# Altium schematic sheet USB-C_BREAKOUT_TITLE.SchDoc
size Tabloid; DocumentNumber: 1; SheetNumber: 1; SheetTotal: 2; Sheet_Name: Title sheet; Size: 11x17
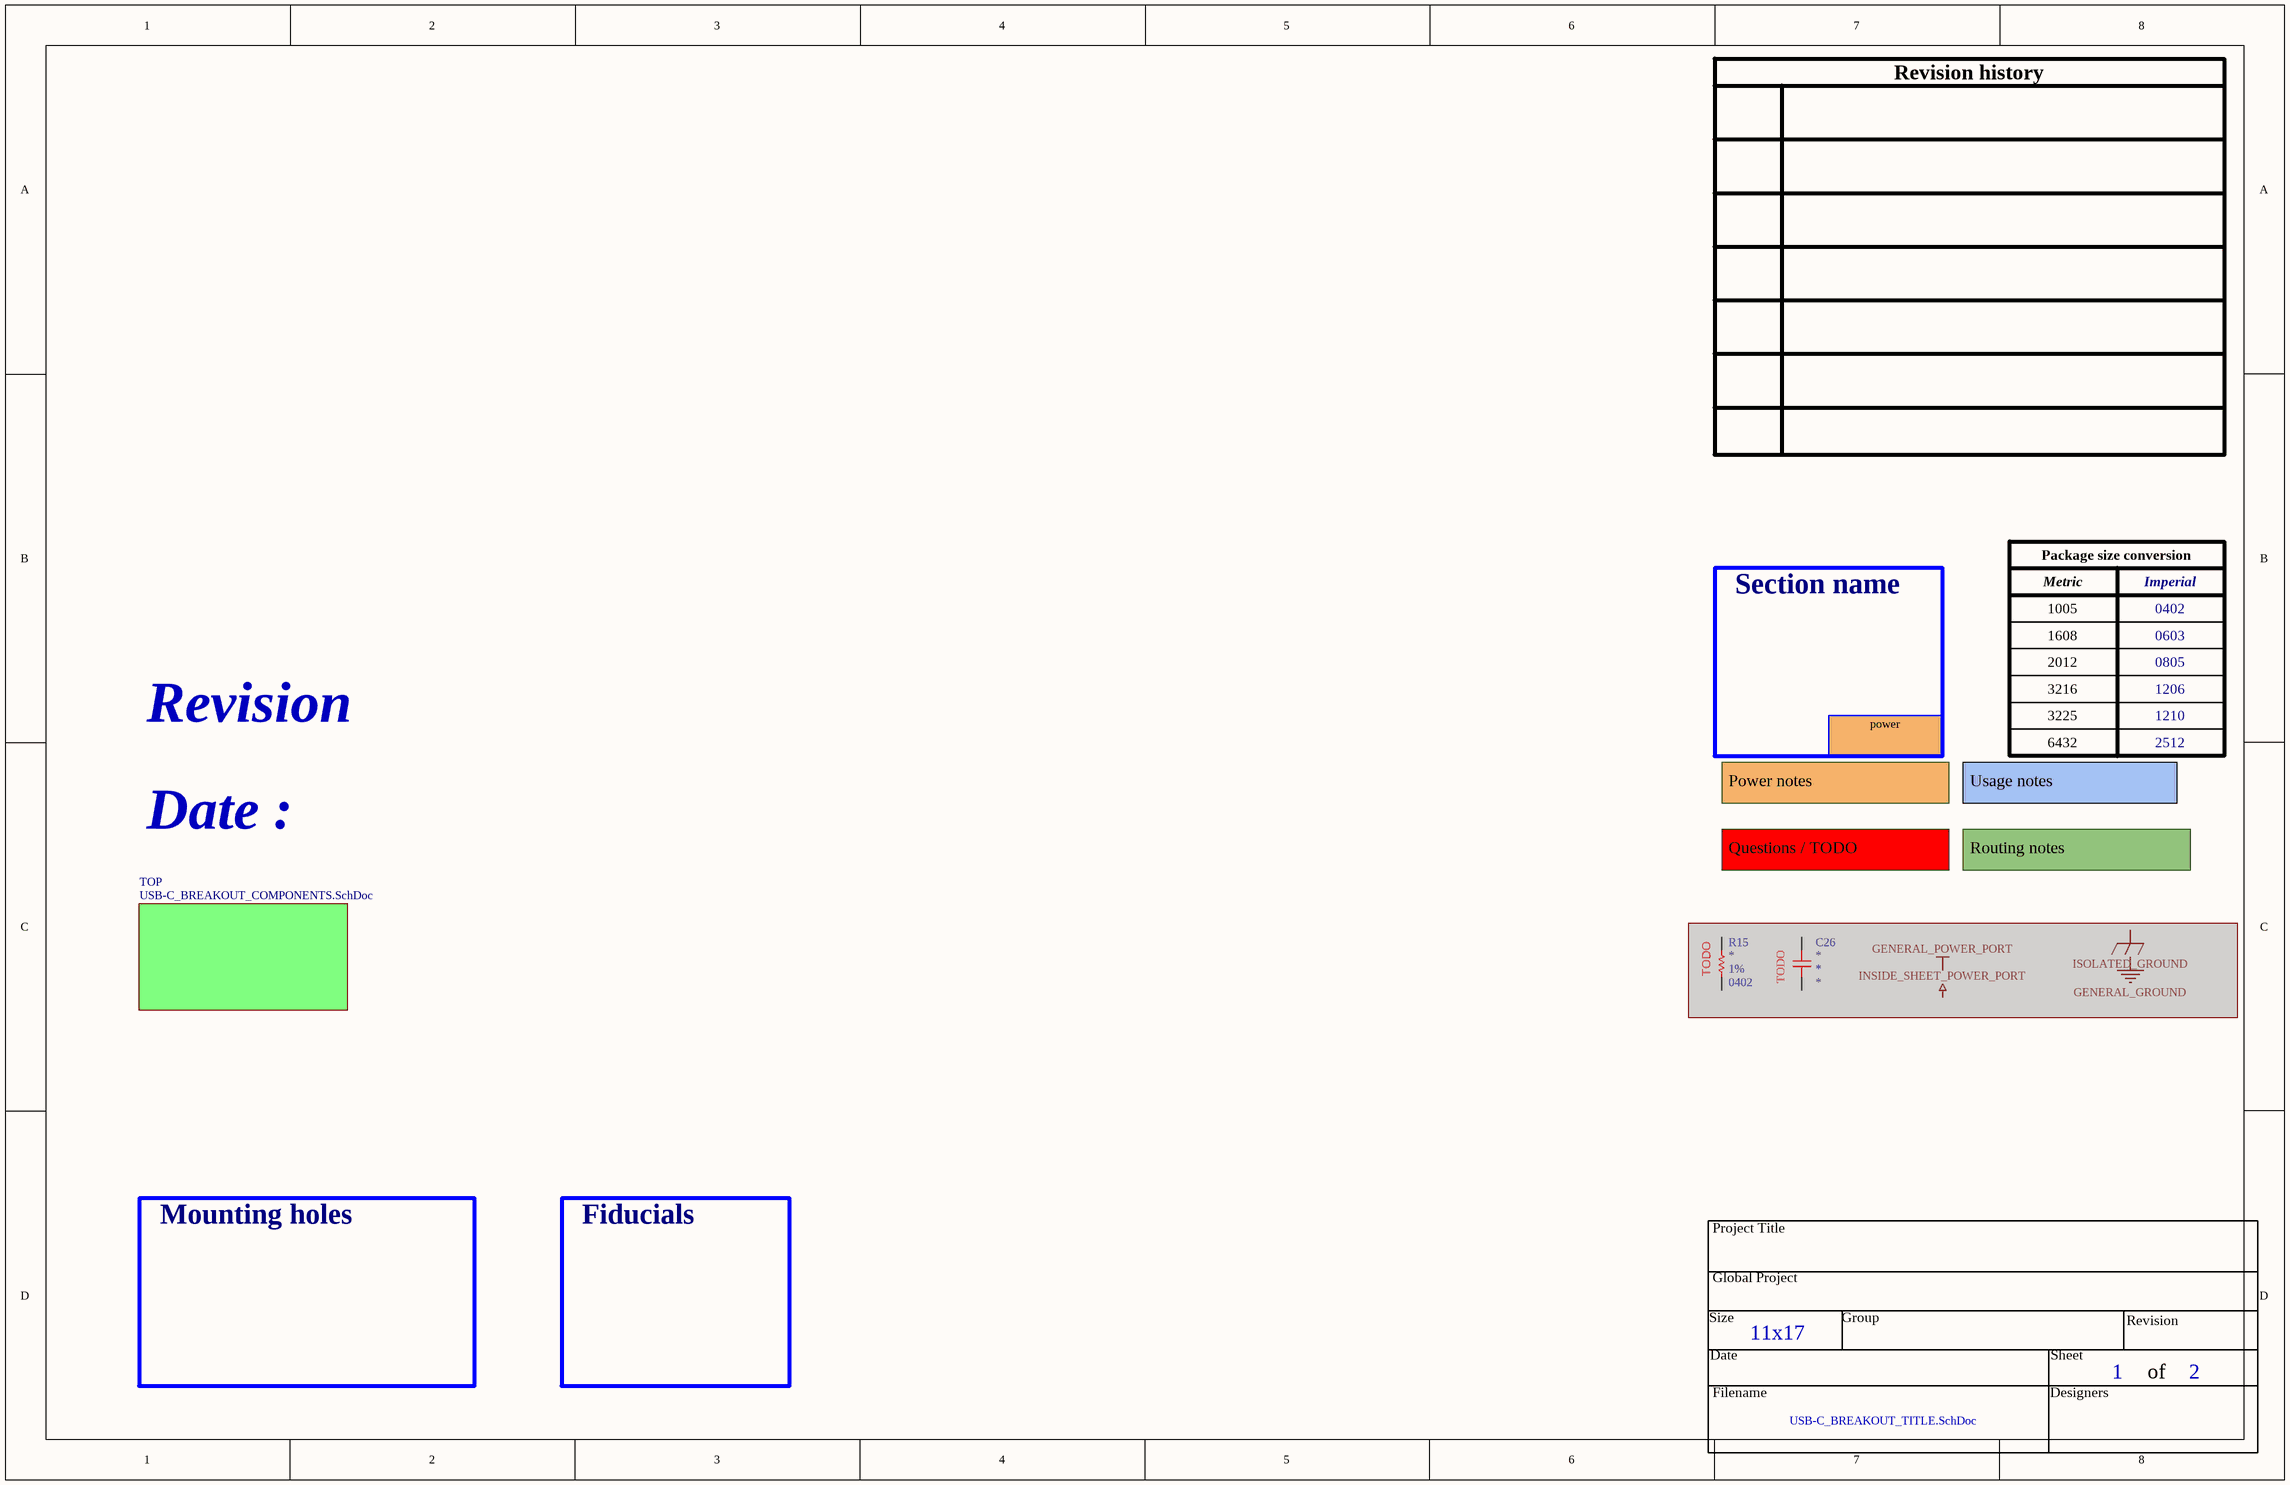
[diagram p0: USB-C_BREAKOUT_TITLE.SchDoc]

## Parts
C26  PRELIM  [CAP_CER_1812]  (value not drawn)  (masked out: inside a compile mask, not in the netlist)
R15  Tolerance: 1%  Package: 0402  [RES_0402]  (hidden comment: PRELIM)  (masked out: inside a compile mask, not in the netlist)

## Sub-sheets
TOP = USB-C_BREAKOUT_COMPONENTS.SchDoc: no entries

## Notes on the sheet
- Section name
- power
- Power notes
- Usage notes
- Questions / TODO
- Routing notes
- Mounting holes
- Fiducials
- Revision history
- Package size conversion
- Metric
- 1005
- 1608
- Imperial
- 0402
- 0603
- Revision
- 2012
- 3216
- 0805
- 1206
- 3225
- 6432
- 1210
- 2512
- Date :
- Project Title
- Global Project
- Size
- Date
- Group
- Sheet
- of
- Filename
- Designers
- (in symbol CAP_CER_PRELIM) TODO
- (in symbol RES_PRELIM) TODO

## Library data of the parts
C26 = CAP_CER_PRELIM: CAP - CER PRELIM; Manufacturer #1: Würth Elektronik; Part Number #1: 885342211009; Tolerance: 10%; GRAMS Lib Spec: 2.8; Magnetic Material: Unknown; Polarized: No; Current Rating: *; Power Max: *; HelpURL: http://www.vishay.com/docs/45228/hvseries.pdf; CreatedBy/Date: Hubert Dube - 03/02/2021; Temperature: -55°C ~ 125°C; Manufacturer #2: *; Note: *; Assembly Type: SMD; Part Number #2: *; Cryo: UNKNOWN; Supplier 1: Digi-Key; Supplier Part Number 1: 732-12109-1-ND; Package: *; Voltage Rating: *; Value: *
R15 = RES_PRELIM: RES -PRELIM; Manufacturer #1: Yageo; Part Number #1: RC0402FR-0775RL; GRAMS Lib Spec: 2.8c; Power Max: 1/16W; Magnetic Material: Unknown; Polarized: No; Voltage Rating: 50V; Assembly Type: SMD; CreatedBy/Date: Hubert Dubé - 3/02/2020; Current Rating: *; HelpURL: https://www.yageo.com/upload/media/product/productsearch/datasheet/rchip/PYu-RC_Group_51_RoHS_L_11.pdf; Manufacturer #2: *; Note: *; Part Number #2: *; Temperature: -55°C ~ 155°C; Value: *